# Altium schematic sheet Sheet5.SchDoc
size A3
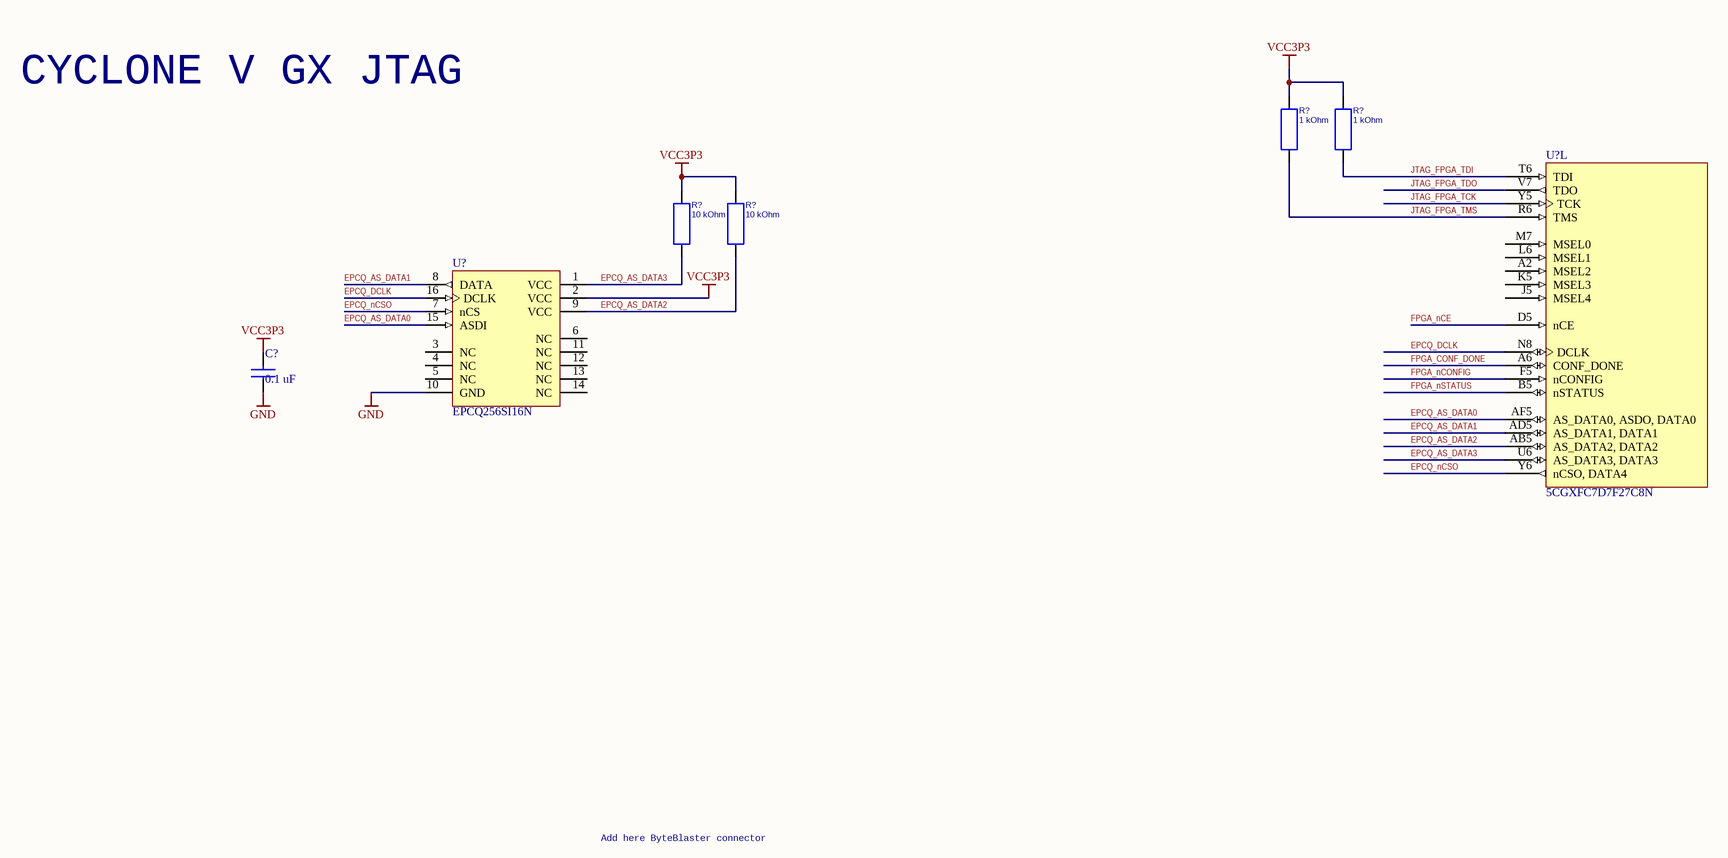
[diagram p0: Sheet5.SchDoc]

## Parts
(Parts that share a designator on the sheet are numbered #1, #2 ... from top to bottom, then left to right.)
C?  0.1 uF  [CAPC1608N]
R?#1  1 kOhm  [RESC1608N]
R?#2  1 kOhm  [RESC1608N]
R?#3  10 kOhm  [RESC1608N]
R?#4  10 kOhm  [RESC1608N]
U?#1  5CGXFC7D7F27C8N  [ALTR-672-FBGA-2000A]  (part L of 15)
U?#2  EPCQ256SI16N  [SOIC16_L]

## Nets
GND: C?.1 U?#2.10(GND)
VCC3P3: C?.2 R?#1.2 R?#2.2 R?#3.2 R?#4.2 U?#2.2(VCC)
EPCQ_AS_DATA0: U?#1.AF5(AS_DATA0,_ASDO,_DATA0) U?#2.15(ASDI)
EPCQ_AS_DATA1: U?#1.AD5(AS_DATA1,_DATA1) U?#2.8(DATA)
EPCQ_AS_DATA2: R?#4.1 U?#1.AB5(AS_DATA2,_DATA2) U?#2.9(VCC)
EPCQ_AS_DATA3: R?#3.1 U?#1.U6(AS_DATA3,_DATA3) U?#2.1(VCC)
EPCQ_DCLK: U?#1.N8(DCLK) U?#2.16(DCLK)
EPCQ_nCSO: U?#1.Y6(nCSO,_DATA4) U?#2.7(nCS)
FPGA_CONF_DONE: U?#1.A6(CONF_DONE)
FPGA_nCE: U?#1.D5(nCE)
FPGA_nCONFIG: U?#1.F5(nCONFIG)
FPGA_nSTATUS: U?#1.B5(nSTATUS)
JTAG_FPGA_TCK: U?#1.Y5(TCK)
JTAG_FPGA_TDI: R?#2.1 U?#1.T6(TDI)
JTAG_FPGA_TDO: U?#1.V7(TDO)
JTAG_FPGA_TMS: R?#1.1 U?#1.R6(TMS)

Not connected (* = marked no-connect by the designer): U?#1 A2(MSEL2) J5(MSEL4) K5(MSEL3) L6(MSEL1) M7(MSEL0); U?#2 3(NC) 4(NC) 5(NC) 6(NC) 11(NC) 12(NC) 13(NC) 14(NC)

## Notes on the sheet
- CYCLONE V GX JTAG
- Add here ByteBlaster connector

## Library data of the parts
C? = CC0603: Vendor: DigiKey; Oper. Temp. Range: -55C to 85C; RoHS: Yes; Package: 0603
R?#1-R?#4 = RC0603: Oper. Temp. Range: -55C to 125C; RoHS: Yes; Package: 0603
U?#1 = 5CGXFC7D7F27C8N: Cyclone V GX Family FPGA, 1.07 to 1.13 V Supply, 336 I/O Pins, 7 PLLs, 672-Pin FBGA, Speed Grade 8, Commercial Grade, RoHS Compliant; Manufacturer: Altera; GPIO: 336; Logic Elements (LE) (K): 149.5; Speed Grade: 8; DatasheetVersion: Rev. 3.1; PackageReference: 672-FBGA-2000A; PackageDescription: 672-Pin FineLine Ball-Grid Array (FBGA), Body 27 x 27 mm, Pitch 1 mm; Supplier 1: Digi-Key; Supplier Part Number 1: 544-2773-ND; Supplier 2: Mouser; Supplier Part Number 2: 989-5CGXFC7D7F27C8N; Device Group: 5CGXFC7; RoHS: RoHS Compliant; Subcategory: Cyclone V GX; Voltage Supply: 1.07 to 1.13 V; Mounting Technology: Surface Mount; Code_JEDEC: MS-034-AAL-1; PartNumber: 5CGXFC7D7F27C8N; ComponentLink1Description: Manufacturer URL; ComponentLink1URL: http://www.altera.com; ComponentLink2Description: Datasheet; ComponentLink2URL: http://www.altera.com/literature/hb/cyclone-v/cv_51002.pdf; ComponentLink3Description: Package Specification; ComponentLink3URL: http://www.altera.com/devicepackaging/04R00427-01.pdf; ComponentLink4Description: Device Handbook URL; ComponentLink4URL: http://www.altera.com/literature/hb/cyclone-v/cyclone5_handbook.pdf; ComponentLink5Description: Device Overview URL; ComponentLink5URL: http://www.altera.com/literature/hb/cyclone-v/cv_51001.pdf; ComponentLink6Description: Device Pin-Out URL; ComponentLink6URL: http://www.altera.com/literature/dp/cyclone-v/1.txt; ComponentLink7Description: Product URL; ComponentLink7URL: http://www.buyaltera.com/scripts/partsearch.dll?Detail&name=5CGXFC7D7F27C8N-ND
U?#2 = EPCQ256SI16N: EPCQ256 Series, In-system programmable 3.3V serial configuration device, 16-Pin SOIC, 128-Megabit, Industrial Grade, Pb-Free; Configures: All Arria series, all Cyclone series and all Stratix series (except Stratix); DatasheetVersion: ver3.0, Dec-2009; PackageVersion: ver14.2, Oct-2005; PackageReference: SOIC16; PackageDescription: 16-Pin Small Outline Integrated Circuit Package (SOIC16); Code_JEDEC: MS-013-AA; Code_IPC: SOIC127P1030-16; ComponentLink1Description: Manufacturer URL; ComponentLink1URL: http://www.altera.com/; ComponentLink2Description: Configuration Handbook; ComponentLink2URL: http://www.altera.com/literature/hb/cfg/config_handbook.pdf; ComponentLink3Description: Pinout; ComponentLink3URL: http://www.altera.com/literature/hb/cfg/config_handbook.pdf; ComponentLink4Description: Package Specification; ComponentLink4URL: http://www.altera.com/support/devices/packaging/specifications/pkg-pin/pdf/016-SOIC.pdf